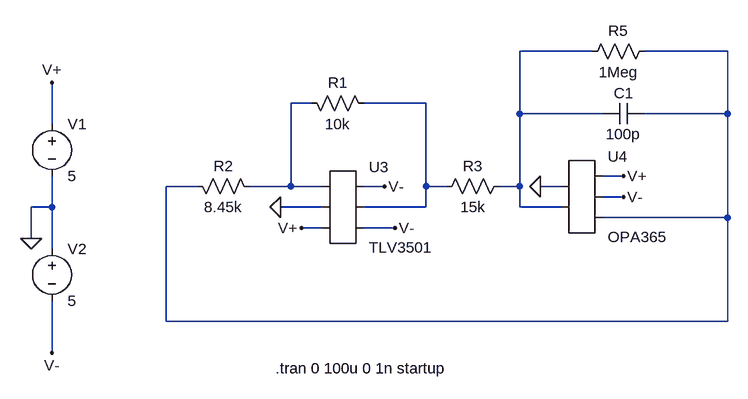
[diagram p0: schematic Generador_triangular_200k_4vp.asc]
Generador_triangular_200k_4vp.asc, the LTspice schematic file:
Version 4
SHEET 1 2944 1632
WIRE -224 608 -336 608
WIRE -16 608 -144 608
WIRE -656 688 -688 688
WIRE -480 688 -576 688
WIRE -336 704 -336 608
WIRE -208 704 -336 704
WIRE -16 704 -16 608
WIRE -16 704 -144 704
WIRE -1056 720 -1056 656
WIRE -176 800 -208 800
WIRE -832 816 -880 816
WIRE -688 816 -688 688
WIRE -688 816 -752 816
WIRE -640 816 -688 816
WIRE -544 816 -576 816
WIRE -480 816 -480 688
WIRE -448 816 -480 816
WIRE -336 816 -336 704
WIRE -336 816 -368 816
WIRE -272 816 -304 816
WIRE -176 832 -208 832
WIRE -1056 848 -1056 800
WIRE -1056 848 -1088 848
WIRE -640 848 -704 848
WIRE -480 848 -480 816
WIRE -480 848 -576 848
WIRE -336 848 -336 816
WIRE -272 848 -336 848
WIRE -16 864 -16 704
WIRE -16 864 -208 864
WIRE -640 880 -672 880
WIRE -528 880 -576 880
WIRE -1088 896 -1088 848
WIRE -1056 912 -1056 848
WIRE -880 1024 -880 816
WIRE -16 1024 -16 864
WIRE -16 1024 -880 1024
WIRE -1056 1072 -1056 992
FLAG -1088 896 0
FLAG -1056 656 V+
FLAG -1056 1072 V-
FLAG -176 800 V+
FLAG -672 880 V+
FLAG -176 832 V-
FLAG -704 848 0
FLAG -544 816 V-
FLAG -304 816 0
FLAG -528 880 V-
SYMBOL voltage -1056 704 R0
WINDOW 123 0 0 Left 2
WINDOW 39 0 0 Left 2
SYMATTR InstName V1
SYMATTR Value 5
SYMBOL voltage -1056 896 R0
WINDOW 123 0 0 Left 2
WINDOW 39 0 0 Left 2
SYMATTR InstName V2
SYMATTR Value 5
SYMBOL res -560 704 M270
WINDOW 0 32 56 VTop 2
WINDOW 3 0 56 VBottom 2
SYMATTR InstName R1
SYMATTR Value 10k
SYMBOL res -736 832 M270
WINDOW 0 32 56 VTop 2
WINDOW 3 0 56 VBottom 2
SYMATTR InstName R2
SYMATTR Value 8.45k
SYMBOL cap -144 688 R90
WINDOW 0 0 32 VBottom 2
WINDOW 3 32 32 VTop 2
SYMATTR InstName C1
SYMATTR Value 100p
SYMBOL res -352 800 R90
WINDOW 0 0 56 VBottom 2
WINDOW 3 32 56 VTop 2
SYMATTR InstName R3
SYMATTR Value 15k
SYMBOL res -128 592 R90
WINDOW 0 0 56 VBottom 2
WINDOW 3 32 56 VTop 2
SYMATTR InstName R5
SYMATTR Value 1Meg
SYMBOL AutoGenerated/TLV3501 -608 848 R0
SYMATTR InstName U3
SYMBOL AutoGenerated/OPA365 -240 832 R0
SYMATTR InstName U4
TEXT -712 1096 Left 2 !.tran 0 100u 0 1n startup

The netlist it stands for:
* Generador_triangular_200k_4vp.asc
V1 V+ 0 5
V2 0 V- 5
R1 N004 N003 10k
R2 N003 N002 8.45k
C1 N002 N001 100p
R3 N001 N004 15k
R5 N002 N001 1Meg
* U3: TLV3501 (symbol AutoGenerated/TLV3501 not available, pins judged from their places): pin1=N003 pin2=0 pin3=V+ pin4=V- pin5=N004 pin6=V-
* U4: OPA365 (symbol AutoGenerated/OPA365 not available, pins judged from their places): pin1=0 pin2=N001 pin3=V+ pin4=V- pin5=N002
.tran 0 100u 0 1n startup
.backanno
.end